# Altium schematic sheet uC.SchDoc
size C; SheetNumber: 1; SheetTotal: 1
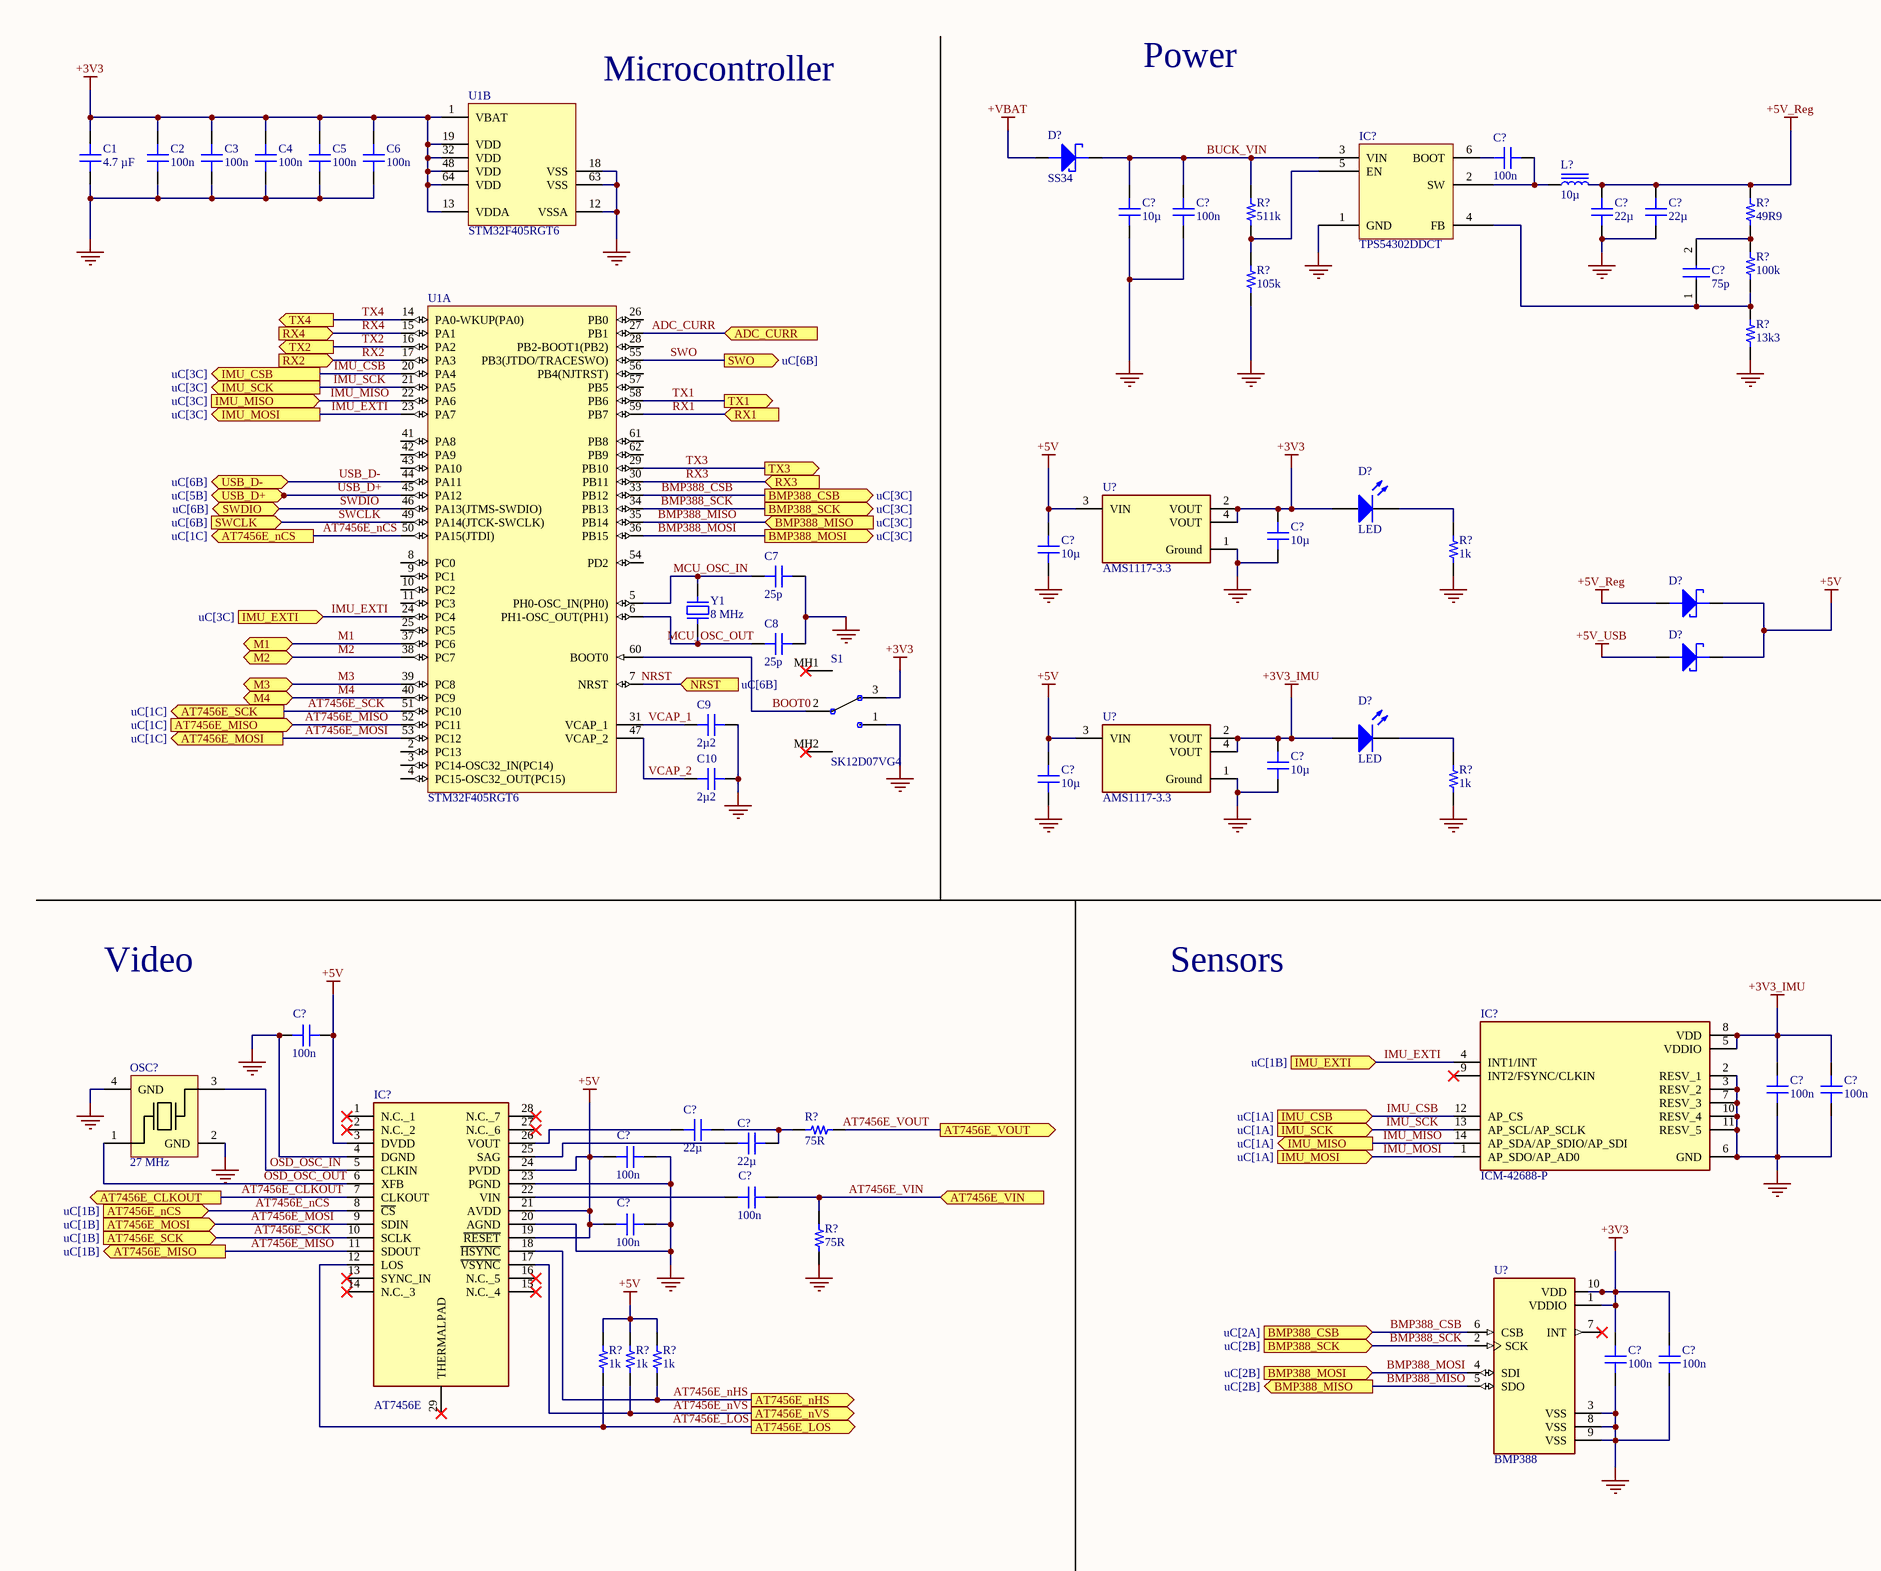
[diagram p0: uC.SchDoc, left]
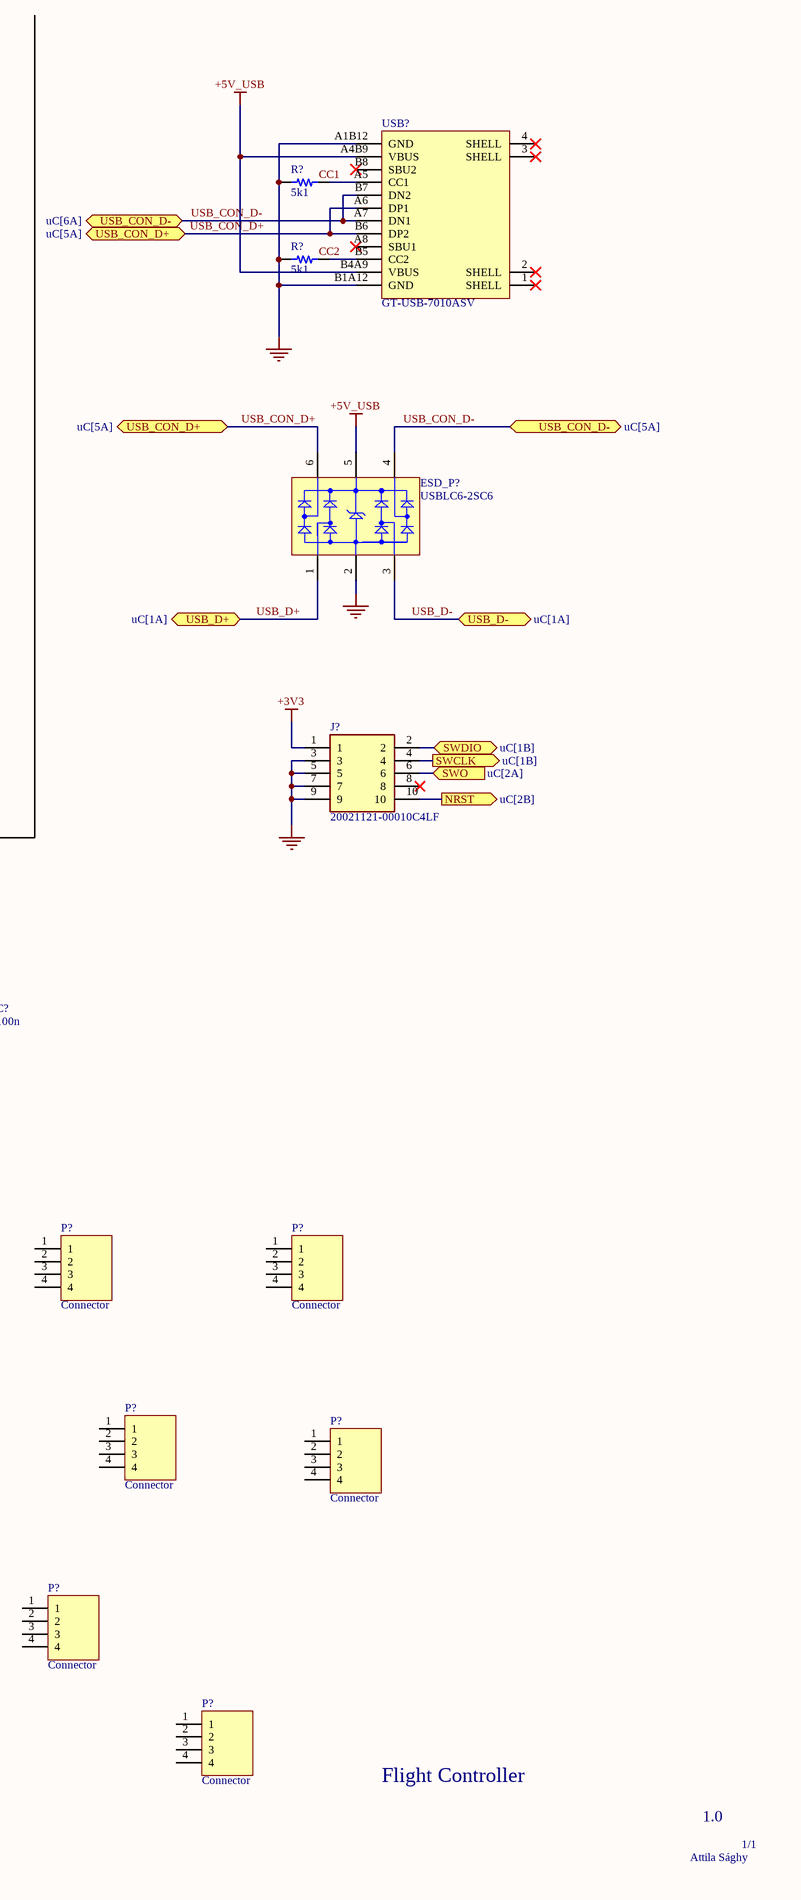
[diagram p1: uC.SchDoc, right]

## Parts
(Parts that share a designator on the sheet are numbered #1, #2 ... from top to bottom, then left to right.)
C1  4.7 µF  [CAP 0805_2012]
C2  Capacitance: 100n  [CAP 0603_1608]  (hidden comment: 0.1 µF)
C3  Capacitance: 100n  [CAP 0603_1608]  (hidden comment: 0.1 µF)
C4  Capacitance: 100n  [CAP 0603_1608]  (hidden comment: 0.1 µF)
C5  Capacitance: 100n  [CAP 0603_1608]  (hidden comment: 0.1 µF)
C6  Capacitance: 100n  [CAP 0603_1608]  (hidden comment: 0.1 µF)
C7  Capacitance: 25p  [CAP 0603_1608]  (hidden comment: 0.1 µF)
C8  Capacitance: 25p  [CAP 0603_1608]  (hidden comment: 0.1 µF)
C9  Capacitance: 2µ2  [CAP 0805_2012]  (hidden comment: 2.2 µF)
C10  Capacitance: 2µ2  [CAP 0805_2012]  (hidden comment: 2.2 µF)
C?#1  Capacitance: 100n  [CAP 0603_1608]  (hidden comment: 0.1 µF)
C?#2  Capacitance: 10µ  [MURATA GRM21B 0805_2012]  (hidden comment: 10 µF)
C?#3  Capacitance: 100n  [CAP 0603_1608]  (hidden comment: 0.1 µF)
C?#4  Capacitance: 22µ  [CAP 0805_2012]  (hidden comment: 22 µF)
C?#5  Capacitance: 22µ  [CAP 0805_2012]  (hidden comment: 22 µF)
C?#6  75p  [CAPC1608X90N]
C?#7  Capacitance: 10µ  [CAP 0805_2012]  (hidden comment: 10 µF)
C?#8  Capacitance: 10µ  [CAP 0805_2012]  (hidden comment: 10 µF)
C?#9  Capacitance: 10µ  [CAP 0805_2012]  (hidden comment: 10 µF)
C?#10  Capacitance: 10µ  [CAP 0805_2012]  (hidden comment: 10 µF)
C?#11  Capacitance: 100n  [CAP 0603_1608]  (hidden comment: 0.1 µF)
C?#12  Capacitance: 100n  [CAP 0603_1608]  (hidden comment: 0.1 µF)
C?#13  Capacitance: 100n  [CAP 0603_1608]  (hidden comment: 0.1 µF)
C?#14  Capacitance: 22µ  [CAP 0805_2012]  (hidden comment: 22 µF)
C?#15  Capacitance: 22µ  [CAP 0805_2012]  (hidden comment: 22 µF)
C?#16  Capacitance: 100n  [CAP 0603_1608]  (hidden comment: 0.1 µF)
C?#17  Capacitance: 100n  [CAP 0603_1608]  (hidden comment: 0.1 µF)
C?#18  Capacitance: 100n  [CAP 0603_1608]  (hidden comment: 0.1 µF)
C?#19  Capacitance: 100n  [CAP 0603_1608]  (hidden comment: 0.1 µF)
C?#20  Capacitance: 100n  [CAP 0603_1608]  (hidden comment: 0.1 µF)
D?#1  SS34  [FP_SMA]
D?#2  LED  [FP_0805_LED_GREEN]
D?#3  (no value)  [FP_SMA]
D?#4  (no value)  [FP_SMA]
D?#5  LED  [FP_0805_LED_GREEN]
ESD_P?  USBLC6-2SC6  [STM-SOT23-6L_V]
IC?#1  TPS54302DDCT  [TI SOT-23-6 DDC]
IC?#2  AT7456E  [SOP65P640X120-29N]
IC?#3  ICM-42688-P  [IIM42352]
J?  20021121-00010C4LF  [2002112100010C4LF]
L?  10µ  [BOURNS SRP5030T]
OSC?  27 MHz
P?#1  Connector  [FP_CONN4_TAP_254MM]
P?#2  Connector  [FP_CONN4_TAP_254MM]
P?#3  Connector  [FP_CONN4_TAP_254MM]
P?#4  Connector  [FP_CONN4_TAP_254MM]
P?#5  Connector  [FP_CONN4_TAP_254MM]
P?#6  Connector  [FP_CONN4_TAP_254MM]
R?#1  511k  [YAGEO RES 0603_1608]
R?#2  49R9  [YAGEO RES 0603_1608]
R?#3  5k1  [YAGEO RES 0603_1608]
R?#4  100k  [YAGEO RES 0603_1608]
R?#5  105k  [YAGEO RES 0603_1608]
R?#6  5k1  [YAGEO RES 0603_1608]
R?#7  13k3  [YAGEO RES 0603_1608]
R?#8  1k  [YAGEO RES 0603_1608]
R?#9  1k  [YAGEO RES 0603_1608]
R?#10  75R  [YAGEO RES 0603_1608]
R?#11  75R  [YAGEO RES 0603_1608]
R?#12  1k  [YAGEO RES 0603_1608]
R?#13  1k  [YAGEO RES 0603_1608]
R?#14  1k  [YAGEO RES 0603_1608]
S1  SK12D07VG4  [SK12D07VG4NSPA]
U1  STM32F405RGT6  [STM-LQFP64_M]  (parts A,B of 2)
U?#1  AMS1117-3.3  [FP-AMS1117-IPC_C]
U?#2  AMS1117-3.3  [FP-AMS1117-IPC_C]
U?#3  BMP388  [PQFN50P200X200X80-10N]
USB?  GT-USB-7010ASV  [USB-C-SMD_G-SWITCH_GT-USB-7010ASV]
Y1  8 MHz  [ABRACON ABLS]

## Ports
ADC_CURR (in), AT7456E_CLKOUT (out), AT7456E_LOS (out), AT7456E_MISO (in, see uC[1C]), AT7456E_MISO (out, see uC[1B]), AT7456E_MOSI (in, see uC[1B]), AT7456E_MOSI (out, see uC[1C]), AT7456E_nCS (in, see uC[1B]), AT7456E_nCS (out, see uC[1C]), AT7456E_nHS (out), AT7456E_nVS (out), AT7456E_SCK (in, see uC[1B]), AT7456E_SCK (out, see uC[1C]), AT7456E_VIN (in), AT7456E_VOUT (out), BMP388_CSB (in, see uC[2A]), BMP388_CSB (out, see uC[3C]), BMP388_MISO (in, see uC[3C]), BMP388_MISO (out, see uC[2B]), BMP388_MOSI (in, see uC[2B]), BMP388_MOSI (out, see uC[3C]), BMP388_SCK (in, see uC[2B]), BMP388_SCK (out, see uC[3C]), IMU_CSB (in, see uC[1A]), IMU_CSB (out, see uC[3C]), IMU_EXTI (in, see uC[1B]), IMU_EXTI (in, see uC[3C]), IMU_MISO (in, see uC[3C]), IMU_MISO (out, see uC[1A]), IMU_MOSI (in, see uC[1A]), IMU_MOSI (out, see uC[3C]), IMU_SCK (in, see uC[1A]), IMU_SCK (out, see uC[3C]), M1 (bidir), M2 (bidir), M3 (bidir), M4 (bidir), NRST (in, see uC[6B]), NRST (out, see uC[2B]), RX1 (in), RX2 (in), RX3 (in), RX4 (in), SWCLK (in, see uC[6B]), SWCLK (out, see uC[1B]), SWDIO (bidir, see uC[1B]), SWDIO (bidir, see uC[6B]), SWO (in, see uC[2A]), SWO (out, see uC[6B]), TX1 (out), TX2 (out), TX3 (out), TX4 (out), USB_CON_D+ (bidir, see uC[5A]), USB_CON_D- (bidir, see uC[5A]), USB_CON_D- (bidir, see uC[6A]), USB_D+ (bidir, see uC[1A]), USB_D+ (bidir, see uC[5B]), USB_D- (bidir, see uC[1A]), USB_D- (bidir, see uC[6B])

## Nets
+3V3: C1.2 C2.2 C3.2 C4.2 C5.2 C6.2 C?#7.2 C?#19.1 C?#20.1 D?#2.1(A) J?.1 S1.3 U1.1(VBAT) U1.13(VDDA) U1.19(VDD) U1.32(VDD) U1.48(VDD) U1.64(VDD) U?#1.2(VOUT) U?#1.4(VOUT) U?#3.1(VDDIO) U?#3.10(VDD)
+3V3_IMU: C?#9.2 C?#12.1 C?#13.1 D?#5.1(A) IC?#3.5(VDDIO) IC?#3.8(VDD) U?#2.2(VOUT) U?#2.4(VOUT)
+5V: C?#8.2 C?#10.2 C?#11.2 C?#16.1 C?#18.1 D?#3.2(CATHODE) D?#4.2(CATHODE) IC?#2.3(DVDD) IC?#2.19(~{RESET}) IC?#2.21(AVDD) IC?#2.24(PVDD) R?#12.2 R?#13.2 R?#14.2 U?#1.3(VIN) U?#2.3(VIN)
+5V_Reg: C?#4.2 C?#5.2 D?#3.1(ANODE) L?.2 R?#2.2
+5V_USB: D?#4.1(ANODE) ESD_P?.5(VBUS) USB?.A4B9(VBUS) USB?.B4A9(VBUS)
+VBAT: D?#1.1(ANODE)
GND: C1.1 C2.1 C3.1 C4.1 C5.1 C6.1 C7.1 C8.1 C9.1 C10.1 C?#2.1 C?#3.2 C?#4.1 C?#5.1 C?#7.1 C?#8.1 C?#9.1 C?#10.1 C?#11.1 C?#12.2 C?#13.2 C?#16.2 C?#18.2 C?#19.2 C?#20.2 ESD_P?.2(GND) IC?#1.1(GND) IC?#2.4(DGND) IC?#2.20(AGND) IC?#2.23(PGND) IC?#3.2(RESV_1) IC?#3.3(RESV_2) IC?#3.6(GND) IC?#3.7(RESV_3) IC?#3.10(RESV_4) IC?#3.11(RESV_5) J?.3 J?.5 J?.7 J?.9 OSC?.2(GND) OSC?.4(GND) R?#3.2 R?#5.1 R?#6.2 R?#7.1 R?#8.1 R?#9.1 R?#11.2 S1.1 U1.12(VSSA) U1.18(VSS) U1.63(VSS) U?#1.1(Ground) U?#2.1(Ground) U?#3.3(VSS) U?#3.8(VSS) U?#3.9(VSS) USB?.A1B12(GND) USB?.B1A12(GND)
ADC_CURR: U1.27(PB1) ; port ADC_CURR
AT7456E_CLKOUT: IC?#2.7(CLKOUT) ; port AT7456E_CLKOUT
AT7456E_LOS: IC?#2.12(LOS) R?#12.1 ; port AT7456E_LOS
AT7456E_MISO: IC?#2.11(SDOUT) U1.52(PC11) ; port AT7456E_MISO
AT7456E_MOSI: IC?#2.9(SDIN) U1.53(PC12) ; port AT7456E_MOSI
AT7456E_nCS: IC?#2.8(~{CS}) U1.50(PA15(JTDI)) ; port AT7456E_nCS
AT7456E_nHS: IC?#2.18(~{HSYNC}) R?#14.1 ; port AT7456E_nHS
AT7456E_nVS: IC?#2.17(~{VSYNC}) R?#13.1 ; port AT7456E_nVS
AT7456E_SCK: IC?#2.10(SCLK) U1.51(PC10) ; port AT7456E_SCK
AT7456E_VIN: C?#17.2 R?#11.1 ; port AT7456E_VIN
AT7456E_VOUT: R?#10.1 ; port AT7456E_VOUT
BMP388_CSB: U1.33(PB12) U?#3.6(CSB) ; port BMP388_CSB
BMP388_MISO: U1.35(PB14) U?#3.5(SDO) ; port BMP388_MISO
BMP388_MOSI: U1.36(PB15) U?#3.4(SDI) ; port BMP388_MOSI
BMP388_SCK: U1.34(PB13) U?#3.2(SCK) ; port BMP388_SCK
BOOT0: S1.2 U1.60(BOOT0)
BUCK_VIN: C?#2.2 C?#3.1 D?#1.2(CATHODE) IC?#1.3(VIN) R?#1.2
CC1: R?#3.1 USB?.A5(CC1)
CC2: R?#6.1 USB?.B5(CC2)
IMU_CSB: IC?#3.12(AP_CS) U1.20(PA4) ; port IMU_CSB
IMU_EXTI: IC?#3.1(AP_SDO/AP_AD0) IC?#3.4(INT1/INT) U1.23(PA7) U1.24(PC4) ; port IMU_MOSI, port IMU_EXTI  [also labelled IMU_MOSI]
IMU_MISO: IC?#3.14(AP_SDA/AP_SDIO/AP_SDI) U1.22(PA6) ; port IMU_MISO
IMU_SCK: IC?#3.13(AP_SCL/AP_SCLK) U1.21(PA5) ; port IMU_SCK
M1: U1.37(PC6) ; port M1
M2: U1.38(PC7) ; port M2
M3: U1.39(PC8) ; port M3
M4: U1.40(PC9) ; port M4
MCU_OSC_IN: C7.2 U1.5(PH0-OSC_IN(PH0)) Y1.1
MCU_OSC_OUT: C8.2 U1.6(PH1-OSC_OUT(PH1)) Y1.2
NRST: J?.10 U1.7(NRST) ; port NRST
OSD_OSC_IN: IC?#2.5(CLKIN) OSC?.3(OSC2)
OSD_OSC_OUT: IC?#2.6(XFB) OSC?.1(OSC1)
RX1: U1.59(PB7) ; port RX1
RX2: U1.17(PA3) ; port RX2
RX3: U1.30(PB11) ; port RX3
RX4: U1.15(PA1) ; port RX4
SWCLK: J?.4 U1.49(PA14(JTCK-SWCLK)) ; port SWCLK
SWDIO: J?.2 U1.46(PA13(JTMS-SWDIO)) ; port SWDIO
SWO: J?.6 U1.55(PB3(JTDO/TRACESWO)) ; port SWO
TX1: U1.58(PB6) ; port TX1
TX2: U1.16(PA2) ; port TX2
TX3: U1.29(PB10) ; port TX3
TX4: U1.14(PA0-WKUP(PA0)) ; port TX4
USB_CON_D+: ESD_P?.6(I/O_4) USB?.A6(DP1) USB?.B6(DP2) ; port USB_CON_D+
USB_CON_D-: ESD_P?.4(I/O_3) USB?.A7(DN1) USB?.B7(DN2) ; port USB_CON_D-
USB_D+: ESD_P?.1(I/O_1) U1.45(PA12) ; port USB_D+
USB_D-: ESD_P?.3(I/O_2) U1.44(PA11) ; port USB_D-
VCAP_1: C9.2 U1.31(VCAP_1)
VCAP_2: C10.2 U1.47(VCAP_2)
NetC?#1_1: C?#1.1 IC?#1.6(BOOT)
NetC?#1_2: C?#1.2 IC?#1.2(SW) L?.1
NetC?#6_1: C?#6.1 IC?#1.4(FB) R?#4.1 R?#7.2
NetC?#6_2: C?#6.2 R?#2.1 R?#4.2
NetC?#14_1: C?#14.1 C?#15.1 R?#10.2
NetC?#14_2: C?#14.2 IC?#2.26(VOUT)
NetC?#15_2: C?#15.2 IC?#2.25(SAG)
NetC?#17_1: C?#17.1 IC?#2.22(VIN)
NetD?#2_2: D?#2.2(K) R?#8.2
NetD?#5_2: D?#5.2(K) R?#9.2
NetIC?#1_5: IC?#1.5(EN) R?#1.1 R?#5.2

Not connected (* = marked no-connect by the designer): IC?#2 1(N.C._1)* 2(N.C._2)* 13(SYNC_IN)* 14(N.C._3)* 15(N.C._4)* 16(N.C._5)* 27(N.C._6)* 28(N.C._7)* 29(THERMALPAD)*; IC?#3 9(INT2/FSYNC/CLKIN)*; J? 8*; P?#1 1 2 3 4; P?#2 1 2 3 4; P?#3 1 2 3 4; P?#4 1 2 3 4; P?#5 1 2 3 4; P?#6 1 2 3 4; S1 MH1* MH2*; U1 2(PC13) 3(PC14-OSC32_IN(PC14)) 4(PC15-OSC32_OUT(PC15)) 8(PC0) 9(PC1) 10(PC2) 11(PC3) 25(PC5) 26(PB0) 28(PB2-BOOT1(PB2)) 41(PA8) 42(PA9) 43(PA10) 54(PD2) 56(PB4(NJTRST)) 57(PB5) 61(PB8) 62(PB9); U?#3 7(INT)*; USB? 1(SHELL)* 2(SHELL)* 3(SHELL)* 4(SHELL)* A8(SBU1)* B8(SBU2)*

## Notes on the sheet
- (near U1) Microcontroller
- Power
- Video
- Sensors
- Flight Controller
- Attila Sághy
- 1.0
- 1/1

## Library data of the parts
C1 = CL21A475KAQNNNE: CAP CER 4.7UF 25V X5R 0805; manufacturer: Samsung Electro-Mechanics; Tolerance: ±10%; Part Number: CL21A475KAQNNNE; Capacitance: 4.7 µF; Applications: General Purpose; componentlink1description: Datasheet; componentlink1url: http://www.samsungsem.com/kr/support/product-search/mlcc/CL21A475KAQNNNE.jsp; componentlink2description: DigiKey Link; componentlink2url: https://www.digikey.com/en/products/detail/samsung-electro-mechanics/CL21A475KAQNNNE/3886902; Device Package: 0805 (2012 Metric); lastupdated: 09/02/2024 20:15:37; Lifecycle Status: Active; Minimum Order: 1; Mounting Type: Surface Mount, MLCC; Operating Temperature: -55°C ~ 85°C; Package / Case: 0805 (2012 Metric); packaging: TapeAndReel; partid: 14321; Part Status: Active; price: 0.01; series: CL; Size / Dimension: 0.079" L x 0.049" W (2.00mm x 1.25mm); Supplier 1: DigiKey; Supplier Part Number 1: 1276-1244-1-ND; Temperature Coefficient: X5R; Thickness (Max): 0.055" (1.40mm); value: 4.7 µF; Voltage - Rated: 25V
C2-C8 C?#1 C?#3 C?#11-C?#13 C?#16-C?#20 = CL10B104KB8NNNC: CAP CER 0.1UF 50V X7R 0603; manufacturer: Samsung Electro-Mechanics; Tolerance: ±10%; Part Number: CL10B104KB8NNNC; Applications: General Purpose; componentlink1description: Datasheet; componentlink1url: http://www.samsungsem.com/kr/support/product-search/mlcc/CL10B104KB8NNNC.jsp; componentlink2description: DigiKey Link; componentlink2url: https://www.digikey.com/en/products/detail/samsung-electro-mechanics/CL10B104KB8NNNC/3886658; Device Package: 0603 (1608 Metric); lastupdated: 09/02/2024 20:10:20; Lifecycle Status: Active; Minimum Order: 1; Mounting Type: Surface Mount, MLCC; Operating Temperature: -55°C ~ 125°C; Package / Case: 0603 (1608 Metric); packaging: TapeAndReel; partid: 9788; Part Status: Active; price: 0.01; series: CL; Size / Dimension: 0.063" L x 0.031" W (1.60mm x 0.80mm); Supplier 1: DigiKey; Supplier Part Number 1: 1276-1000-1-ND; Temperature Coefficient: X7R; Thickness (Max): 0.035" (0.90mm); value: 0.1 µF; Voltage - Rated: 50V
C9 C10 = CL21B225KAFNNNE: CAP CER 2.2UF 25V X7R 0805; manufacturer: Samsung Electro-Mechanics; Tolerance: ±10%; Part Number: CL21B225KAFNNNE; Applications: General Purpose; componentlink1description: Datasheet; componentlink1url: http://www.samsungsem.com/kr/support/product-search/mlcc/CL21B225KAFNNNE.jsp; componentlink2description: DigiKey Link; componentlink2url: https://www.digikey.com/en/products/detail/samsung-electro-mechanics/CL21B225KAFNNNE/3888612; Device Package: 0805 (2012 Metric); lastupdated: 09/02/2024 20:15:21; Lifecycle Status: Active; Minimum Order: 1; Mounting Type: Surface Mount, MLCC; Operating Temperature: -55°C ~ 125°C; Package / Case: 0805 (2012 Metric); packaging: TapeAndReel; partid: 17958; Part Status: Active; price: 0.02; series: CL; Size / Dimension: 0.079" L x 0.049" W (2.00mm x 1.25mm); Supplier 1: DigiKey; Supplier Part Number 1: 1276-2954-1-ND; Temperature Coefficient: X7R; Thickness (Max): 0.053" (1.35mm); value: 2.2 µF; Voltage - Rated: 25V
C?#2 = GRM21BR61H106KE43L: CAP CER 10UF 50V X5R 0805; manufacturer: Murata Electronics; Tolerance: ±10%; Part Number: GRM21BR61H106KE43L; Applications: Mobile Devices Only; componentlink1description: Datasheet; componentlink1url: https://search.murata.co.jp/Ceramy/image/img/A01X/G101/ENG/GRM21BR61H106KE43-01A.pdf; componentlink2description: DigiKey Link; componentlink2url: https://www.digikey.com/en/products/detail/murata-electronics/GRM21BR61H106KE43L/10326316; Device Package: 0805 (2012 Metric); lastupdated: 27/08/2024 09:29:56; Lifecycle Status: Active; Minimum Order: 1; Mounting Type: Surface Mount, MLCC; Operating Temperature: -55°C ~ 85°C; Package / Case: 0805 (2012 Metric); packaging: TapeAndReel; partid: 39284; Part Status: Active; price: 0.05; series: GRM; Size / Dimension: 0.079" L x 0.049" W (2.00mm x 1.25mm); Supplier 1: DigiKey; Supplier Part Number 1: 490-18663-1-ND; Temperature Coefficient: X5R; Thickness (Max): 0.057" (1.45mm); value: 10 µF; Voltage - Rated: 50V
C?#4 C?#5 C?#14 C?#15 = CL21A226KOQNNNE: CAP CER 22UF 16V X5R 0805; manufacturer: Samsung Electro-Mechanics; Tolerance: ±10%; Part Number: CL21A226KOQNNNE; Applications: General Purpose; componentlink1description: Datasheet; componentlink1url: http://www.samsungsem.com/kr/support/library/product-catalog/mlcc.jsp; componentlink2description: DigiKey Link; componentlink2url: https://www.digikey.com/en/products/detail/samsung-electro-mechanics/CL21A226KOQNNNE/5961010; Device Package: 0805 (2012 Metric); lastupdated: 09/02/2024 20:16:07; Lifecycle Status: Active; Minimum Order: 1; Mounting Type: Surface Mount, MLCC; Operating Temperature: -55°C ~ 85°C; Package / Case: 0805 (2012 Metric); packaging: TapeAndReel; partid: 3004; Part Status: Active; price: 0.06; series: CL; Size / Dimension: 0.079" L x 0.049" W (2.00mm x 1.25mm); Supplier 1: DigiKey; Supplier Part Number 1: 1276-6526-1-ND; Temperature Coefficient: X5R; Thickness (Max): 0.055" (1.40mm); value: 22 µF; Voltage - Rated: 16V
C?#6 = 0603CG750J500NT: Capacitor; Manufacturer_Name: FH(Guangdong Fenghua Advanced Tech); Datasheet Link: https://datasheet.lcsc.com/lcsc/1811061811_FH--Guangdong-Fenghua-Advanced-Tech-0603CG750J500NT_C1681.pdf; Height: 0.9mm; Manufacturer_Part_Number: 0603CG750J500NT
C?#7-C?#10 = CL21A106KAYNNNE: CAP CER 10UF 25V X5R 0805; manufacturer: Samsung Electro-Mechanics; Tolerance: ±10%; Part Number: CL21A106KAYNNNE; Applications: General Purpose; componentlink1description: Datasheet; componentlink1url: http://www.samsungsem.com/kr/support/product-search/mlcc/CL21A106KAYNNNE.jsp; componentlink2description: DigiKey Link; componentlink2url: https://www.digikey.com/en/products/detail/samsung-electro-mechanics/CL21A106KAYNNNE/3888549; Device Package: 0805 (2012 Metric); lastupdated: 09/02/2024 20:15:41; Lifecycle Status: Active; Minimum Order: 1; Mounting Type: Surface Mount, MLCC; Operating Temperature: -55°C ~ 85°C; Package / Case: 0805 (2012 Metric); packaging: TapeAndReel; partid: 13105; Part Status: Active; price: 0.02; series: CL; Size / Dimension: 0.079" L x 0.049" W (2.00mm x 1.25mm); Supplier 1: DigiKey; Supplier Part Number 1: 1276-2891-1-ND; Temperature Coefficient: X5R; Thickness (Max): 0.057" (1.45mm); value: 10 µF; Voltage - Rated: 25V
D?#1 D?#3 D?#4 = SCHOTTKY: Schottky diode
D?#2 D?#5 = LED: Typical RED GaAs LED; pin to pad: 1>A 2>K
ESD_P? = CMP-2000-05378-1: Very low capacitance ESD protection, 3.5 pF, -40 to 125 degC, 6-Pin SOT23, RoHS, Tape and Reel; Manufacturer: STMicroelectronics; Polarity: Uni-Directional; Clamping Voltage: 17V; Rad Hardened: No; Product Height (mm): 1.3mm; Leakage Current (Max): 0.15uA; Product Length (mm): 3.05mm; Number of Elements: 1; Peak Pulse Current: 5A; Configuration: Dual; Reverse Breakdown Voltage: 6V; Working Voltage (Max): 5V; Capacitance Value: 3.5pF; Suppressor Type: DiodeArrays; Product Depth (mm): 1.75mm; Test Current (It): 1mA; Package / Case: SOT-23; Operating Temperature Max Deg. C: 125C; Package Description: 6-Pin Small Outline Transistor, Body 2.925 x 1.625 mm, Pitch 0.95 mm; Package Reference: SOT23-6L; Datasheet Version: Rev. 5, 10/2011; Operating Temperature Min Deg. C: -40C; Mounting Style: SurfaceMount; Direction Type: Uni-Directional; Mounting: SurfaceMount; Pin Count: 6; Leakage Current: 0.15uA; Packaging: TapeandReel; Operating Temperature Classification: Automotive; Clamping Voltage (Max): 17V; Manufacturer URL: http://www.st.com/; Reverse Stand-off Voltage: 5V; Datasheet URL: http://www.st.com/st-web-ui/static/active/en/resource/technical/document/datasheet/CD00050750.pdf; Working Voltage: 5V; Operating Temp Range: -40Cto125C
IC?#1 = TPS54302DDCT: IC REG BUCK ADJ 3A TSOT23-6; Manufacturer: Texas Instruments; Frequency - Switching: 400kHz; Function: Step-Down; Number of Outputs: 1; Output Configuration: Positive; Output Type: Adjustable; Synchronous Rectifier: Yes; Voltage - Input (Max): 28V; Voltage - Input (Min): 4.5V; Voltage - Output (Min/Fixed): 0.596V; Part Number: TPS54302DDCT; ComponentLink1Description: Datasheet; ComponentLink1URL: http://www.ti.com/general/docs/suppproductinfo.tsp?distId=10&gotoUrl=http%3A%2F%2Fwww.ti.com%2Flit%2Fgpn%2Ftps54302; ComponentLink2Description: DigiKey Link; ComponentLink2URL: http://digikey.com/product-detail/en/texas-instruments/TPS54302DDCT/296-44542-1-ND/6128450; Current - Output: 3A; Device Package: SOT-23-6 Thin, TSOT-23-6; LastUpdated: 04/02/2020 14:31:43; Lifecycle Status: Active; Minimum Order: 1; Mounting Type: Surface Mount; Operating Temperature: -40°C ~ 125°C (TJ); Package / Case: SOT-23-6 Thin, TSOT-23-6; Packaging: TapeAndReel; Part Status: Active; Price: 1.06; Series: -; Supplier 1: DigiKey; Supplier Part Number 1: 296-44542-1-ND; Supplier Device Package: TSOT-23-6; Topology: Buck; Voltage - Output (Max): 28V
IC?#2 = AT7456E: Integrated Circuit; Manufacturer_Name: ICOF; Datasheet Link: https://datasheet.lcsc.com/szlcsc/ZHONGKEWEI-AT7456E_C82351.pdf; Height: 1.2mm; Manufacturer_Part_Number: AT7456E
IC?#3 = ICM-42688-P: Integrated Circuit; Manufacturer_Name: TDK; Datasheet Link: https://3cfeqx1hf82y3xcoull08ihx-wpengine.netdna-ssl.com/wp-content/uploads/2021/06/DS-000347-ICM-42688-P-v1.5.pdf; Manufacturer_Part_Number: ICM-42688-P; Mouser Part Number: 410-ICM-42688-P; Mouser Price/Stock: https://www.mouser.co.uk/ProductDetail/TDK-InvenSense/ICM-42688-P?qs=OlC7AqGiEDk8QrNAV728zw%3D%3D; Arrow Part Number: ICM-42688-P; Arrow Price/Stock: https://www.arrow.com/en/products/icm-42688-p/invensense?utm_currency=USD&region=nac
J? = 20021121-00010C4LF: Connector; Manufacturer_Name: Amphenol; Datasheet Link: https://cdn.amphenol-cs.com/media/wysiwyg/files/drawing/20021121.pdf; Height: 5.7mm; Manufacturer_Part_Number: 20021121-00010C4LF; Mouser Part Number: 649-202112100010C4LF; Mouser Price/Stock: https://www.mouser.co.uk/ProductDetail/Amphenol-FCI/20021121-00010C4LF?qs=iIVTEDlrHA1ddfCJGH4Nhg%3D%3D
L? = SRP5030T-100M: FIXED IND 10UH 2.75A 128MOHM SMD; Manufacturer: Bourns Inc.; Current - Saturation: 3.5A; DC Resistance (DCR): 128mOhm Max; Inductance: 10 µH; Inductance Frequency - Test: 100 kHz; Material - Core: Iron Powder; Shielding: Shielded; Tolerance: ±20%; Type: Drum Core, Wirewound; Value: 10 µH; Part Number: SRP5030T-100M; ComponentLink1Description: Datasheet; ComponentLink1URL: https://www.bourns.com/docs/Product-Datasheets/SRP5030T.pdf; ComponentLink2Description: DigiKey Link; ComponentLink2URL: https://www.digikey.com/en/products/detail/bourns-inc/SRP5030T-100M/3986087; Current Rating (Amps): 2.75 A; Device Package: Nonstandard; Height - Seated (Max): 0.118" (3.00mm); LastUpdated: 03/06/2024 20:02:35; Lifecycle Status: Active; Minimum Order: 1; Mounting Type: Surface Mount; Operating Temperature: -40°C ~ 125°C; Package / Case: Nonstandard; Packaging: TapeAndReel; PartId: 9; Part Status: Active; Price: 0.59; Series: SRP5030T; Size / Dimension: 0.224" L x 0.205" W (5.70mm x 5.20mm); Supplier 1: DigiKey; Supplier Part Number 1: SRP5030T-100MCT-ND
OSC? = X322527MSB4SI
P?#1-P?#6 = Connector_4pin: 4pin Connector
R?#1 = RC0603FR-07511KL: RES 511K OHM 1% 1/10W 0603; Manufacturer: Yageo; Power (Watts): 0.1W, 1/10W; Resistance: 511 kOhms; Temperature Coefficient: ±100ppm/°C; Part Number: RC0603FR-07511KL; Value: 511k; ComponentLink1Description: Datasheet; ComponentLink1URL: https://www.yageo.com/upload/media/product/productsearch/datasheet/rchip/PYu-RC_Group_51_RoHS_L_10.pdf; ComponentLink2Description: DigiKey Link; ComponentLink2URL: https://www.digikey.com/en/products/detail/yageo/RC0603FR-07511KL/727288; Composition: Thick Film; Device Package: 0603 (1608 Metric); Features: Moisture Resistant; Height - Seated (Max): 0.022" (0.55mm); LastUpdated: 25/07/2024 09:19:31; Lifecycle Status: Active; Minimum Order: 1; Number of Terminations: 2; Operating Temperature: -55°C ~ 155°C; Package / Case: 0603 (1608 Metric); Packaging: CutTape; PartId: 7757; Part Status: Active; Price: 0.01; Series: RC_L; Size / Dimension: 0.063" L x 0.031" W (1.60mm x 0.80mm); Supplier 1: DigiKey; Supplier Part Number 1: 311-511KHRCT-ND; Supplier Device Package: 0603; Tolerance: ±1%
R?#2 = RC0603FR-0749R9L: RES 49.9 OHM 1% 1/10W 0603; Manufacturer: Yageo; Power (Watts): 0.1W, 1/10W; Resistance: 49.9 Ohms; Temperature Coefficient: ±100ppm/°C; Part Number: RC0603FR-0749R9L; Value: 49R9; ComponentLink1Description: Datasheet; ComponentLink1URL: https://www.yageo.com/upload/media/product/productsearch/datasheet/rchip/PYu-RC_Group_51_RoHS_L_10.pdf; ComponentLink2Description: DigiKey Link; ComponentLink2URL: https://www.digikey.com/en/products/detail/yageo/RC0603FR-0749R9L/727264; Composition: Thick Film; Device Package: 0603 (1608 Metric); Features: Moisture Resistant; Height - Seated (Max): 0.022" (0.55mm); LastUpdated: 25/07/2024 09:19:17; Lifecycle Status: Active; Minimum Order: 1; Number of Terminations: 2; Operating Temperature: -55°C ~ 155°C; Package / Case: 0603 (1608 Metric); Packaging: CutTape; PartId: 23951; Part Status: Active; Price: 0.01; Series: RC_L; Size / Dimension: 0.063" L x 0.031" W (1.60mm x 0.80mm); Supplier 1: DigiKey; Supplier Part Number 1: 311-49.9HRCT-ND; Supplier Device Package: 0603; Tolerance: ±1%
R?#3 R?#6 = RC0603FR-075K1L: RES 5.1K OHM 1% 1/10W 0603; Manufacturer: Yageo; Power (Watts): 0.1W, 1/10W; Resistance: 5.1 kOhms; Temperature Coefficient: ±100ppm/°C; Part Number: RC0603FR-075K1L; Value: 5k1; ComponentLink1Description: Datasheet; ComponentLink1URL: https://www.yageo.com/upload/media/product/productsearch/datasheet/rchip/PYu-RC_Group_51_RoHS_L_10.pdf; ComponentLink2Description: DigiKey Link; ComponentLink2URL: https://www.digikey.com/en/products/detail/yageo/RC0603FR-075K1L/727268; Composition: Thick Film; Device Package: 0603 (1608 Metric); Features: Moisture Resistant; Height - Seated (Max): 0.022" (0.55mm); LastUpdated: 25/07/2024 09:19:21; Lifecycle Status: Active; Minimum Order: 1; Number of Terminations: 2; Operating Temperature: -55°C ~ 155°C; Package / Case: 0603 (1608 Metric); Packaging: CutTape; PartId: 18982; Part Status: Active; Price: 0.01; Series: RC_L; Size / Dimension: 0.063" L x 0.031" W (1.60mm x 0.80mm); Supplier 1: DigiKey; Supplier Part Number 1: 311-5.10KHRCT-ND; Supplier Device Package: 0603; Tolerance: ±1%
R?#4 = RC0603FR-07100KL: RES 100K OHM 1% 1/10W 0603; Manufacturer: Yageo; Power (Watts): 0.1W, 1/10W; Resistance: 100 kOhms; Temperature Coefficient: ±100ppm/°C; Part Number: RC0603FR-07100KL; Value: 100k; ComponentLink1Description: Datasheet; ComponentLink1URL: https://www.yageo.com/upload/media/product/productsearch/datasheet/rchip/PYu-RC_Group_51_RoHS_L_10.pdf; ComponentLink2Description: DigiKey Link; ComponentLink2URL: https://www.digikey.com/en/products/detail/yageo/RC0603FR-07100KL/726889; Composition: Thick Film; Device Package: 0603 (1608 Metric); Features: Moisture Resistant; Height - Seated (Max): 0.022" (0.55mm); LastUpdated: 25/07/2024 09:19:17; Lifecycle Status: Active; Minimum Order: 1; Number of Terminations: 2; Operating Temperature: -55°C ~ 155°C; Package / Case: 0603 (1608 Metric); Packaging: CutTape; PartId: 23948; Part Status: Active; Price: 0.01; Series: RC_L; Size / Dimension: 0.063" L x 0.031" W (1.60mm x 0.80mm); Supplier 1: DigiKey; Supplier Part Number 1: 311-100KHRCT-ND; Supplier Device Package: 0603; Tolerance: ±1%
R?#5 = RC0603FR-07105KL: RES 105K OHM 1% 1/10W 0603; Manufacturer: Yageo; Power (Watts): 0.1W, 1/10W; Resistance: 105 kOhms; Temperature Coefficient: ±100ppm/°C; Part Number: RC0603FR-07105KL; Value: 105k; ComponentLink1Description: Datasheet; ComponentLink1URL: https://www.yageo.com/upload/media/product/productsearch/datasheet/rchip/PYu-RC_Group_51_RoHS_L_10.pdf; ComponentLink2Description: DigiKey Link; ComponentLink2URL: https://www.digikey.com/en/products/detail/yageo/RC0603FR-07105KL/726893; Composition: Thick Film; Device Package: 0603 (1608 Metric); Features: Moisture Resistant; Height - Seated (Max): 0.022" (0.55mm); LastUpdated: 25/07/2024 09:19:32; Lifecycle Status: Active; Minimum Order: 1; Number of Terminations: 2; Operating Temperature: -55°C ~ 155°C; Package / Case: 0603 (1608 Metric); Packaging: CutTape; PartId: 7511; Part Status: Active; Price: 0.01; Series: RC_L; Size / Dimension: 0.063" L x 0.031" W (1.60mm x 0.80mm); Supplier 1: DigiKey; Supplier Part Number 1: 311-105KHRCT-ND; Supplier Device Package: 0603; Tolerance: ±1%
R?#7 = RC0603FR-0713K3L: RES 13.3K OHM 1% 1/10W 0603; Manufacturer: Yageo; Power (Watts): 0.1W, 1/10W; Resistance: 13.3 kOhms; Temperature Coefficient: ±100ppm/°C; Part Number: RC0603FR-0713K3L; Value: 13k3; ComponentLink1Description: Datasheet; ComponentLink1URL: https://www.yageo.com/upload/media/product/productsearch/datasheet/rchip/PYu-RC_Group_51_RoHS_L_10.pdf; ComponentLink2Description: DigiKey Link; ComponentLink2URL: https://www.digikey.com/en/products/detail/yageo/RC0603FR-0713K3L/726931; Composition: Thick Film; Device Package: 0603 (1608 Metric); Features: Moisture Resistant; Height - Seated (Max): 0.022" (0.55mm); LastUpdated: 25/07/2024 09:19:28; Lifecycle Status: Active; Minimum Order: 1; Number of Terminations: 2; Operating Temperature: -55°C ~ 155°C; Package / Case: 0603 (1608 Metric); Packaging: CutTape; PartId: 12236; Part Status: Active; Price: 0.01; Series: RC_L; Size / Dimension: 0.063" L x 0.031" W (1.60mm x 0.80mm); Supplier 1: DigiKey; Supplier Part Number 1: 311-13.3KHRCT-ND; Supplier Device Package: 0603; Tolerance: ±1%
R?#8 R?#9 R?#12-R?#14 = RC0603FR-071KL: RES 1K OHM 1% 1/10W 0603; Manufacturer: Yageo; Power (Watts): 0.1W, 1/10W; Resistance: 1 kOhms; Temperature Coefficient: ±100ppm/°C; Part Number: RC0603FR-071KL; Value: 1k; ComponentLink1Description: Datasheet; ComponentLink1URL: https://www.yageo.com/upload/media/product/productsearch/datasheet/rchip/PYu-RC_Group_51_RoHS_L_10.pdf; ComponentLink2Description: DigiKey Link; ComponentLink2URL: https://www.digikey.com/en/products/detail/yageo/RC0603FR-071KL/726843; Composition: Thick Film; Device Package: 0603 (1608 Metric); Features: Moisture Resistant; Height - Seated (Max): 0.022" (0.55mm); LastUpdated: 25/07/2024 09:19:19; Lifecycle Status: Active; Minimum Order: 1; Number of Terminations: 2; Operating Temperature: -55°C ~ 155°C; Package / Case: 0603 (1608 Metric); Packaging: CutTape; PartId: 22600; Part Status: Active; Price: 0.01; Series: RC_L; Size / Dimension: 0.063" L x 0.031" W (1.60mm x 0.80mm); Supplier 1: DigiKey; Supplier Part Number 1: 311-1.00KHRCT-ND; Supplier Device Package: 0603; Tolerance: ±1%
R?#10 R?#11 = RC0603FR-0775RL: RES 75 OHM 1% 1/10W 0603; Manufacturer: Yageo; Power (Watts): 0.1W, 1/10W; Resistance: 75 Ohms; Temperature Coefficient: ±100ppm/°C; Part Number: RC0603FR-0775RL; Value: 75R; ComponentLink1Description: Datasheet; ComponentLink1URL: https://www.yageo.com/upload/media/product/productsearch/datasheet/rchip/PYu-RC_Group_51_RoHS_L_10.pdf; ComponentLink2Description: DigiKey Link; ComponentLink2URL: https://www.digikey.com/en/products/detail/yageo/RC0603FR-0775RL/727377; Composition: Thick Film; Device Package: 0603 (1608 Metric); Features: Moisture Resistant; Height - Seated (Max): 0.022" (0.55mm); LastUpdated: 25/07/2024 09:19:21; Lifecycle Status: Active; Minimum Order: 1; Number of Terminations: 2; Operating Temperature: -55°C ~ 155°C; Package / Case: 0603 (1608 Metric); Packaging: CutTape; PartId: 18934; Part Status: Active; Price: 0.01; Series: RC_L; Size / Dimension: 0.063" L x 0.031" W (1.60mm x 0.80mm); Supplier 1: DigiKey; Supplier Part Number 1: 311-75.0HRCT-ND; Supplier Device Package: 0603; Tolerance: ±1%
S1 = SK12D07VG4NSPA: Switch; Manufacturer_Name: C & K COMPONENTS; Datasheet Link: https://www.digikey.com/en/products/detail/c-k/SK12D07VG4NSPA/3861707?msockid=2ab7f999c9c96f4c2a13ec8dc8dd6eef; Height: 4.7mm; Manufacturer_Part_Number: SK12D07VG4NSPA; Mouser Part Number: 611-SK12D07VG4NSPA; Mouser Price/Stock: https://www.mouser.co.uk/ProductDetail/CK/SK12D07VG4NSPA?qs=Gufeu08L%2Fl2yE%252Bwit3a%252BZg%3D%3D; Arrow Part Number: SK12D07VG4NSPA; Arrow Price/Stock: https://www.arrow.com/en/products/sk12d07vg4nspa/ck?region=nac
U1 = CMP-0243-00019-3: ARM Cortex-M4 32-bit MCU+FPU, 210 DMIPS, 1024 kB Flash, 192 kB Internal RAM, 51 I/Os, 64-pin LQFP, -40 to 85 degC, Tray; Manufacturer: STMicroelectronics; Supply Voltage(Vcc) min (V): 1.8; Supply Voltage(Vcc) max (V): 3.6; Internal RAM Size (kB): 192; I/Os (High Current): 51; D/A Converter: 2x12-bit; FLASH Size (Prog) (kB): 1024; Operating Frequency(F) (Processor speed) (MHz): 168; ComponentLink2Description: Datasheet; PackageVersion: Rev. 4, 06/2013; DatasheetVersion: Rev. 4; Core: ARM Cortex-M4; ComponentLink2URL: http://www.st.com/st-web-ui/static/active/en/resource/technical/document/datasheet/DM00037051.pdf; PackageReference: LQFP64; Packing: Tray; ComponentLink1Description: Manufacturer URL; ComponentLink3URL: http://www.st.com/st-web-ui/static/active/en/resource/technical/document/datasheet/DM00037051.pdf; ComponentLink3Description: Package Specification; Mounting Technology: Surface Mount; ComponentLink1URL: http://www.st.com/web/en/home.html; PackageDescription: 64-Pin Low Profile Quad Flat Package, 10 x 10 mm Body, 0.5 mm Pitch; PartNumber: STM32F405RGT6
U?#1 U?#2 = CMP-209535-000001-1: LDO Voltage Regulators 1A, 3.3V; Manufacturer: Advanced Monolithic Systems; Dropout Voltage: 1.1V; Output Type: Fixed; Nominal Supply Current: 5mA; Max Power Dissipation: 1.2W; Max Supply Voltage: 15V; Number Of Outputs: 1; Standoff Height: 0.64mm; Max Junction Temp: +125°C; Height: 1.8mm; Package: AMS1117; Device Class L2: Power Management ICs; ComponentLink2Description: Datasheet; ComponentLink2URL: http://www.advanced-monolithic.com/pdf/ds1117.pdf; Category: IC; RoHS: TRUE; Automotive: No; Device Class L1: Integrated Circuits (ICs); Output Current: 1A; Device Class L3: Voltage Regulators - Linear; Temperature: -40°C to +125°C; Output Voltage: 3.3V; Manufacturer Part Number: AMS1117-3.3; Temperature Range Low: -40°C; Octopart: https://octopart.com/ams1117-3.3-advanced+monolithic+systems-25899300; Lead Free: Yes; Ipc Land Pattern Name: SOT229P700X180-4; Temperature Range High: +125°C
U?#3 = BMP388: P-Sensor SPI I2C 1, 25 Bar SMD; Package: None; Price: None; Value: *; MP: BMP388; Availability: Unavailable
Y1 = ABLS-8.000MHZ-SD7Y-T: CRYSTAL 8.0000MHZ 18PF SMD; Manufacturer: Abracon LLC; ESR (Equivalent Series Resistance): 80 Ohms; Frequency Stability: ±30ppm; Frequency Tolerance: ±15ppm; Operating Mode: Fundamental; Part Number: ABLS-8.000MHZ-SD7Y-T; ComponentLink1Description: Datasheet; ComponentLink1URL: https://abracon.com/Resonators/abls.pdf; ComponentLink2Description: DigiKey Link; ComponentLink2URL: https://www.digikey.com/en/products/detail/abracon-llc/ABLS-8-000MHZ-SD7Y-T/8581989; Frequency: 8 MHz; Height - Seated (Max): 0.165" (4.20mm); LastUpdated: 03/06/2024 20:02:02; Lifecycle Status: Active; Load Capacitance: 18pF; Minimum Order: 1; Mounting Type: Surface Mount; Operating Temperature: -40°C ~ 85°C; Package / Case: HC-49/US; Packaging: CutTape; PartId: 25; Part Status: Active; Price: 0.27; Series: ABLS; Size / Dimension: 0.449" L x 0.185" W (11.40mm x 4.70mm); Supplier 1: DigiKey; Supplier Part Number 1: 535-14365-2-ND; Type: MHz Crystal; Value: 8 MHz